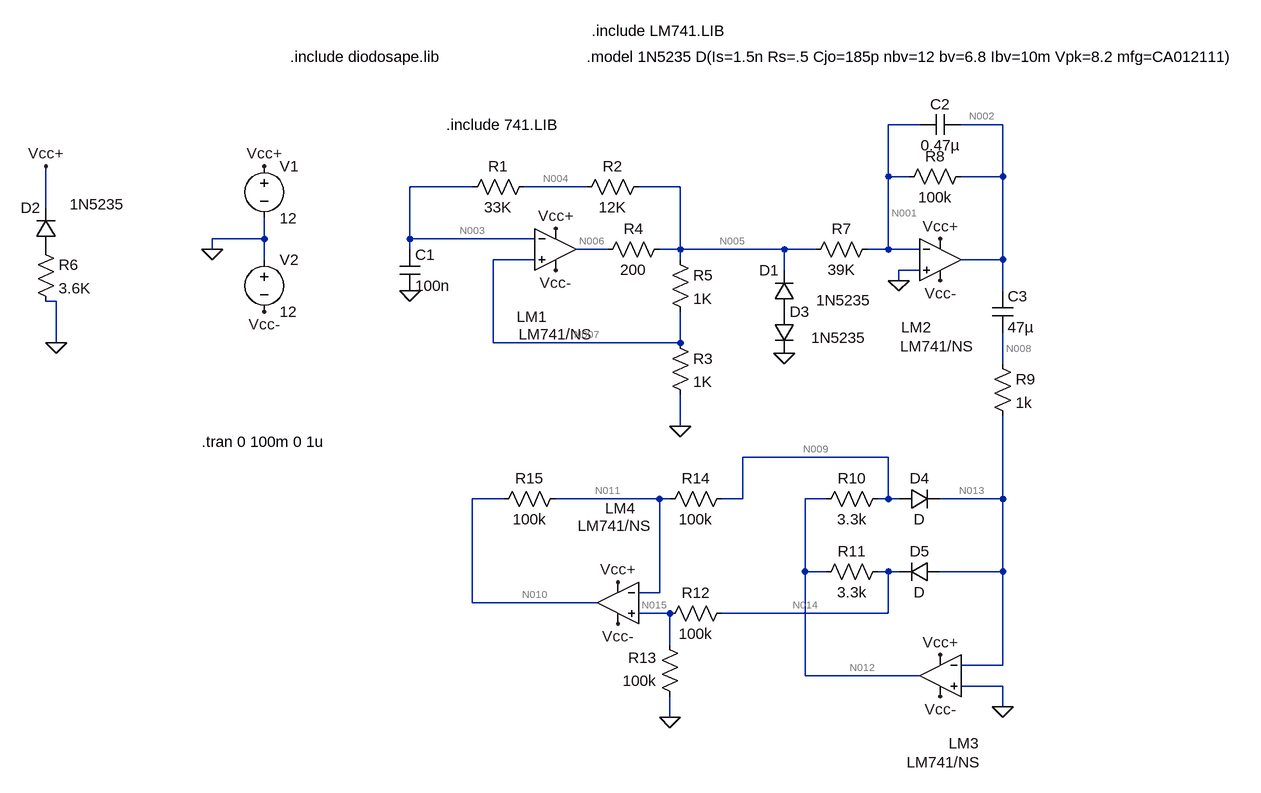
[diagram p0: schematic esquematico.asc]
esquematico.asc, the LTspice schematic file:
Version 4
SHEET 1 1432 920
WIRE 832 -80 784 -80
WIRE 960 -80 896 -80
WIRE 784 0 784 -80
WIRE 816 0 784 0
WIRE 960 0 960 -80
WIRE 960 0 896 0
WIRE 144 16 48 16
WIRE 320 16 224 16
WIRE 464 16 400 16
WIRE -512 48 -512 -16
WIRE -176 96 -176 64
WIRE -176 96 -256 96
WIRE 48 96 48 16
WIRE 240 96 48 96
WIRE -256 112 -256 96
WIRE 48 112 48 96
WIRE 352 112 304 112
WIRE 464 112 464 16
WIRE 464 112 432 112
WIRE 624 112 464 112
WIRE 672 112 624 112
WIRE 784 112 784 0
WIRE 784 112 752 112
WIRE 832 112 784 112
WIRE -176 128 -176 96
WIRE 240 128 176 128
WIRE 464 128 464 112
WIRE 960 128 960 0
WIRE 960 128 896 128
WIRE 624 144 624 112
WIRE 832 144 800 144
WIRE 800 160 800 144
WIRE 960 176 960 128
WIRE -496 192 -512 192
WIRE -496 256 -496 192
WIRE 176 256 176 128
WIRE 464 256 464 208
WIRE 464 256 176 256
WIRE 960 288 960 240
WIRE 464 384 464 336
WIRE 784 432 560 432
WIRE 192 496 144 496
WIRE 432 496 272 496
WIRE 448 496 432 496
WIRE 560 496 560 432
WIRE 560 496 528 496
WIRE 688 496 656 496
WIRE 784 496 784 432
WIRE 784 496 768 496
WIRE 800 496 784 496
WIRE 960 496 960 368
WIRE 960 496 864 496
WIRE 656 608 656 496
WIRE 688 608 656 608
WIRE 784 608 768 608
WIRE 800 608 784 608
WIRE 960 608 960 496
WIRE 960 608 864 608
WIRE 432 640 432 496
WIRE 432 640 400 640
WIRE 144 656 144 496
WIRE 336 656 144 656
WIRE 448 672 400 672
WIRE 784 672 784 608
WIRE 784 672 528 672
WIRE 448 720 448 672
WIRE 960 752 960 608
WIRE 960 752 896 752
WIRE 656 768 656 608
WIRE 832 768 656 768
WIRE 960 784 896 784
WIRE 960 816 960 784
WIRE 448 832 448 800
FLAG 464 384 0
FLAG -176 -16 Vcc+
FLAG 272 80 Vcc+
FLAG -176 208 Vcc-
FLAG 272 144 Vcc-
FLAG -256 112 0
FLAG 48 176 0
FLAG 624 272 0
FLAG -512 -16 Vcc+
FLAG -496 256 0
FLAG 800 160 0
FLAG 864 96 Vcc+
FLAG 864 160 Vcc-
FLAG 864 736 Vcc+
FLAG 864 800 Vcc-
FLAG 368 624 Vcc+
FLAG 368 688 Vcc-
FLAG 448 832 0
FLAG 960 816 0
SYMBOL cap 32 112 R0
SYMATTR InstName C1
SYMATTR Value 100n
SYMBOL res 240 0 R90
WINDOW 0 0 56 VBottom 2
WINDOW 3 32 56 VTop 2
SYMATTR InstName R1
SYMATTR Value 33K
SYMBOL res 416 0 R90
WINDOW 0 0 56 VBottom 2
WINDOW 3 32 56 VTop 2
SYMATTR InstName R2
SYMATTR Value 12K
SYMBOL OpAmps\\UniversalOpAmp2 272 112 R0
WINDOW 3 -57 131 Left 2
WINDOW 0 -60 104 Left 2
SYMATTR Value LM741/NS
SYMATTR InstName LM1
SYMATTR SpiceModel ""
SYMBOL res 448 240 R0
SYMATTR InstName R3
SYMATTR Value 1K
SYMBOL res 448 96 R90
WINDOW 0 0 56 VBottom 2
WINDOW 3 32 56 VTop 2
SYMATTR InstName R4
SYMATTR Value 200
SYMBOL res 448 112 R0
SYMATTR InstName R5
SYMATTR Value 1K
SYMBOL voltage -176 -32 R0
WINDOW 123 0 0 Left 0
WINDOW 39 0 0 Left 0
SYMATTR InstName V1
SYMATTR Value 12
SYMBOL voltage -176 112 R0
WINDOW 123 0 0 Left 0
WINDOW 39 0 0 Left 0
SYMATTR InstName V2
SYMATTR Value 12
SYMBOL diode 640 208 R180
WINDOW 0 24 64 Left 2
WINDOW 3 -118 18 Left 2
SYMATTR InstName D1
SYMATTR Value 1N5235
SYMBOL diode 608 208 R0
WINDOW 3 57 40 Left 2
SYMATTR Value 1N5235
SYMATTR InstName D3
SYMBOL diode -496 112 R180
WINDOW 0 24 64 Left 2
WINDOW 3 -105 69 Left 2
SYMATTR InstName D2
SYMATTR Value 1N5235
SYMBOL res -528 96 R0
SYMATTR InstName R6
SYMATTR Value 3.6K
SYMBOL res 768 96 R90
WINDOW 0 0 56 VBottom 2
WINDOW 3 32 56 VTop 2
SYMATTR InstName R7
SYMATTR Value 39K
SYMBOL OpAmps\\UniversalOpAmp2 864 128 R0
WINDOW 3 -62 133 Left 2
WINDOW 0 -60 104 Left 2
SYMATTR Value LM741/NS
SYMATTR InstName LM2
SYMATTR SpiceModel ""
SYMBOL res 912 -16 R90
WINDOW 0 0 56 VBottom 2
WINDOW 3 32 56 VTop 2
SYMATTR InstName R8
SYMATTR Value 100k
SYMBOL cap 896 -96 R90
WINDOW 0 0 32 VBottom 2
WINDOW 3 32 32 VTop 2
SYMATTR InstName C2
SYMATTR Value 0.47µ
SYMBOL cap 944 176 R0
SYMATTR InstName C3
SYMATTR Value 47µ
SYMBOL res 944 272 R0
SYMATTR InstName R9
SYMATTR Value 1k
SYMBOL diode 800 512 R270
WINDOW 0 32 32 VTop 2
WINDOW 3 0 32 VBottom 2
SYMATTR InstName D4
SYMBOL diode 864 592 R90
WINDOW 0 0 32 VBottom 2
WINDOW 3 32 32 VTop 2
SYMATTR InstName D5
SYMBOL res 784 480 R90
WINDOW 0 0 56 VBottom 2
WINDOW 3 32 56 VTop 2
SYMATTR InstName R10
SYMATTR Value 3.3k
SYMBOL res 784 592 R90
WINDOW 0 0 56 VBottom 2
WINDOW 3 32 56 VTop 2
SYMATTR InstName R11
SYMATTR Value 3.3k
SYMBOL OpAmps\\UniversalOpAmp2 864 768 M0
WINDOW 3 -62 133 Left 2
WINDOW 0 -60 104 Left 2
SYMATTR Value LM741/NS
SYMATTR InstName LM3
SYMATTR SpiceModel ""
SYMBOL OpAmps\\UniversalOpAmp2 368 656 M0
WINDOW 3 -52 -119 Left 2
WINDOW 0 -28 -146 Left 2
SYMATTR Value LM741/NS
SYMATTR InstName LM4
SYMATTR SpiceModel ""
SYMBOL res 544 656 R90
WINDOW 0 0 56 VBottom 2
WINDOW 3 32 56 VTop 2
SYMATTR InstName R12
SYMATTR Value 100k
SYMBOL res 464 816 R180
WINDOW 0 36 76 Left 2
WINDOW 3 36 40 Left 2
SYMATTR InstName R13
SYMATTR Value 100k
SYMBOL res 544 480 R90
WINDOW 0 0 56 VBottom 2
WINDOW 3 32 56 VTop 2
SYMATTR InstName R14
SYMATTR Value 100k
SYMBOL res 288 480 R90
WINDOW 0 0 56 VBottom 2
WINDOW 3 32 56 VTop 2
SYMATTR InstName R15
SYMATTR Value 100k
TEXT 104 -80 Left 2 !.include 741.LIB
TEXT -272 408 Left 2 !.tran 0 100m 0 1u
TEXT -136 -184 Left 2 !.include diodosape.lib
TEXT 320 -184 Left 2 !.model 1N5235 D(Is=1.5n Rs=.5 Cjo=185p nbv=12 bv=6.8 Ibv=10m Vpk=8.2 mfg=CA012111)
TEXT 328 -224 Left 2 !.include LM741.LIB

The netlist it stands for:
* esquematico.asc
C1 N003 0 100n
R1 N004 N003 33K
R2 N005 N004 12K
XLM1 N007 N003 Vcc+ Vcc- N006 LM741/NS Avol=1Meg GBW=10Meg Slew=10Meg Ilimit=25m Rail=0 Vos=0 En=0 Enk=0 In=0 Ink=0 Rin=500Meg  ; pins In+ In- V+ V- OUT
R3 N007 0 1K
R4 N005 N006 200
R5 N005 N007 1K
V1 Vcc+ 0 12
V2 0 Vcc- 12
D1 P001 N005 1N5235
D3 P001 0 1N5235
D2 P002 Vcc+ 1N5235
R6 P002 0 3.6K
R7 N001 N005 39K
XLM2 0 N001 Vcc+ Vcc- N002 LM741/NS Avol=1Meg GBW=10Meg Slew=10Meg Ilimit=25m Rail=0 Vos=0 En=0 Enk=0 In=0 Ink=0 Rin=500Meg  ; pins In+ In- V+ V- OUT
R8 N002 N001 100k
C2 N002 N001 0.47µ
C3 N002 N008 47µ
R9 N008 N013 1k
D4 N009 N013 D
D5 N013 N014 D
R10 N009 N012 3.3k
R11 N014 N012 3.3k
XLM3 0 N013 Vcc+ Vcc- N012 LM741/NS Avol=1Meg GBW=10Meg Slew=10Meg Ilimit=25m Rail=0 Vos=0 En=0 Enk=0 In=0 Ink=0 Rin=500Meg  ; pins In+ In- V+ V- OUT
XLM4 N015 N011 Vcc+ Vcc- N010 LM741/NS Avol=1Meg GBW=10Meg Slew=10Meg Ilimit=25m Rail=0 Vos=0 En=0 Enk=0 In=0 Ink=0 Rin=500Meg  ; pins In+ In- V+ V- OUT
R12 N014 N015 100k
R13 0 N015 100k
R14 N009 N011 100k
R15 N011 N010 100k
.model D D
.lib standard.dio
.include 741.LIB
.tran 0 100m 0 1u
.include diodosape.lib
.model 1N5235 D(Is=1.5n Rs=.5 Cjo=185p nbv=12 bv=6.8 Ibv=10m Vpk=8.2 mfg=CA012111)
.include LM741.LIB
.lib UniversalOpAmp2.lib
.backanno
.end

* Results of the author's LTspice run, read from the files saved beside the schematic
* Operating Point, zero values left out:
*   V(n003) = 3.548 mV
*   V(n004) = 6.18 mV
*   V(n005) = 7.137 mV
*   V(n006) = 7.912 mV
*   V(vcc-) = -12 V
*   V(vcc+) = 12 V
*   V(n007) = 3.529 mV
*   V(p001) = 3.376 mV
*   V(p002) = 5.768 V
*   V(n001) = 19.3 µV
*   V(n002) = -10.26 mV
*   V(n008) = 17.15 µV
*   V(n013) = 17.15 µV
*   V(n009) = 411.1 mV
*   V(n014) = 411.3 mV
*   V(n012) = 418.2 mV
*   V(n010) = 282.7 µV
*   V(n011) = 201.7 mV
*   V(n015) = 201.7 mV
*   I(D1) = -206.1 pA
*   I(D3) = 206.1 pA
*   I(D2) = -1.602 mA
*   I(D4) = 79.76 nA
*   I(R1) = 79.77 nA
*   I(R2) = 79.77 nA
*   I(R3) = 3.529 µA
*   I(R4) = -3.871 µA
*   I(R5) = 3.609 µA
*   I(R6) = 1.602 mA
*   I(R7) = -182.5 nA
*   I(R8) = -102.8 nA
*   I(R10) = -2.174 µA
*   I(R11) = -2.096 µA
*   I(R12) = 2.096 µA
*   I(R13) = -2.017 µA
*   I(R14) = 2.094 µA
*   I(R15) = 2.014 µA
*   I(V1) = -6.948 mA
*   I(V2) = -5.347 mA
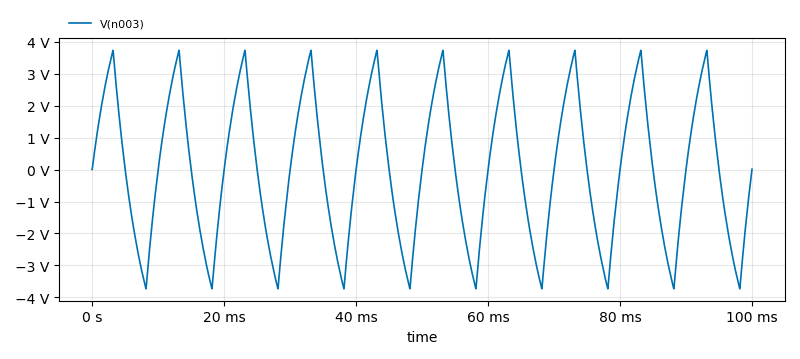
[diagram p1: Transient Analysis of esquematico.asc, plotted from the saved traces]
* Transient Analysis, 1 run:
*   V(n003): min -3.734 V, max 3.734 V, average 405.2 µV, rms 2.26 V, last 9.802 mV